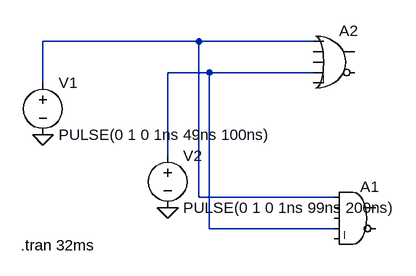
[diagram p0: schematic Draft1.asc]
Draft1.asc, the LTspice schematic file:
Version 4
SHEET 1 880 680
WIRE -80 -16 -320 -16
WIRE 96 -16 -80 -16
WIRE -64 32 -128 32
WIRE 96 32 -64 32
WIRE -320 48 -320 -16
WIRE -128 160 -128 32
WIRE -80 224 -80 -16
WIRE 128 224 -80 224
WIRE -64 272 -64 32
WIRE 128 272 -64 272
FLAG -128 240 0
FLAG -320 128 0
SYMBOL Digital\\and 160 192 R0
SYMATTR InstName A1
SYMBOL voltage -320 32 R0
WINDOW 123 0 0 Left 0
WINDOW 39 0 0 Left 0
SYMATTR InstName V1
SYMATTR Value PULSE(0 1 0 1ns 49ns 100ns)
SYMBOL voltage -128 144 R0
WINDOW 123 0 0 Left 0
WINDOW 39 0 0 Left 0
SYMATTR InstName V2
SYMATTR Value PULSE(0 1 0 1ns 99ns 200ns)
SYMBOL Digital\\or 128 -48 R0
SYMATTR InstName A2
TEXT -354 298 Left 2 !.tran 32ms

The netlist it stands for:
* Draft1.asc
A1 N001 0 0 N002 0 0 0 0 AND
V1 N001 0 PULSE(0 1 0 1ns 49ns 100ns)
V2 N002 0 PULSE(0 1 0 1ns 99ns 200ns)
A2 N001 0 0 N002 0 0 0 0 OR
.tran 32ms
.backanno
.end